# EAGLE schematic diffs (EAGLE 7.5.0)
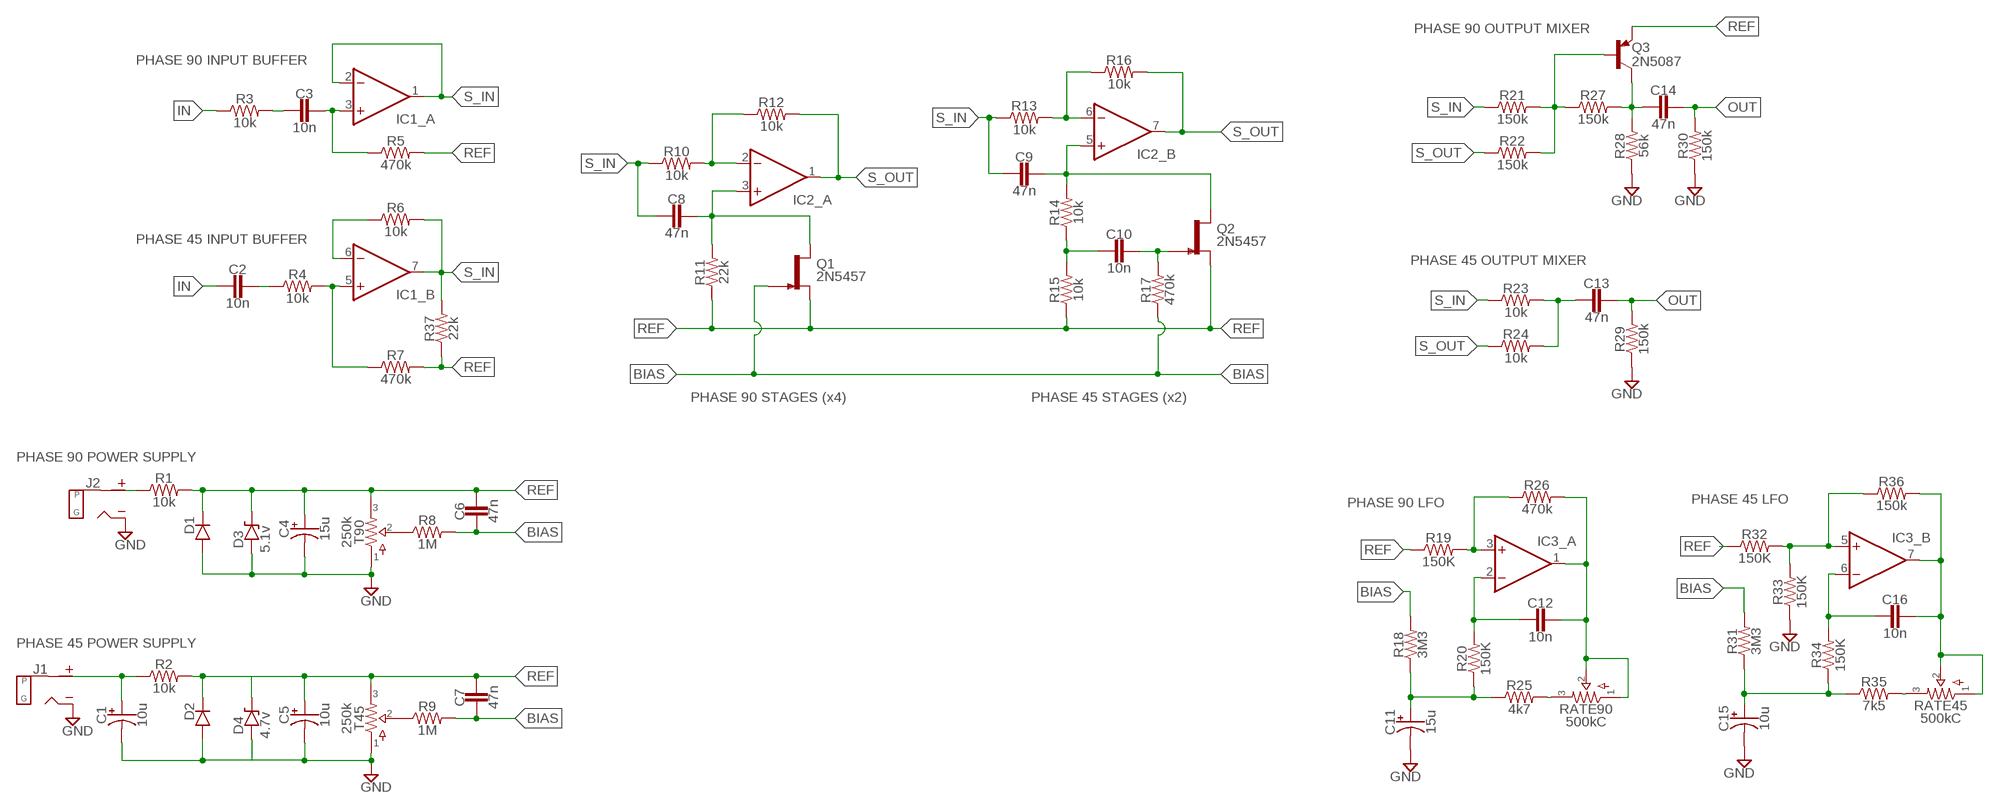
[diagram p0: schematic, sheet 1]

## Parts
C1  10u  0501B  [050_020_1B]
C2  10n  CER/FILM2  [050X030_025_2]
C3  10n  CER/FILM2  [050X030_025_2]
C4  15u  0501B  [050_020_1B]
C5  10u  0501B  [050_020_1B]
C6  47n  CER/FILM2  [050X030_025_2]
C7  47n  CER/FILM2  [050X030_025_2]
C8  47n  CER/FILM2  [050X030_025_2]
C9  47n  CER/FILM2  [050X030_025_2]
C10  10n  CER/FILM2  [050X030_025_2]
C11  15u  0501B  [050_020_1B]
C12  10n  CER/FILM2  [050X030_025_2]
C13  47n  CER/FILM2  [050X030_025_2]
C14  47n  CER/FILM2  [050X030_025_2]
C15  10u  0501B  [050_020_1B]
C16  10n  CER/FILM2  [050X030_025_2]
D1  DO35.3  [DO35-3]
D2  DO35.3  [DO35-3]
D3  5.1v  ZENER.3  [DO41-3]
D4  4.7v  ZENER.3  [DO41-3]
IC1  DUALTH  [DIL08]
IC2  QUADTH  [DIL14]
IC3  DUALTH  [DIL08]
J1  DC_MONO  [DC]
J2  DC_MONO  [DC]
Q1  2N5457  [TO92-]
Q2  2N5457  [TO92-]
Q3  2N5087  2N5087.1  [TO92-]
R1  10k  R_.2  [R0207/2V]
R2  10k  R_.2  [R0207/2V]
R3  10k  R_.2  [R0207/2V]
R4  10k  R_.2  [R0207/2V]
R5  470k  R_.2  [R0207/2V]
R6  10k  R_.2  [R0207/2V]
R7  470k  R_.2  [R0207/2V]
R8  1M  R_.2  [R0207/2V]
R9  1M  R_.2  [R0207/2V]
R10  10k  R_.2  [R0207/2V]
R11  22k  R_.2  [R0207/2V]
R12  10k  R_.2  [R0207/2V]
R13  10k  R_.2  [R0207/2V]
R14  10k  R_.2  [R0207/2V]
R15  10k  R_.2  [R0207/2V]
R16  10k  R_.2  [R0207/2V]
R17  470k  R_.2  [R0207/2V]
R18  3M3  R_.2  [R0207/2V]
R19  150K  R_.2  [R0207/2V]
R20  150K  R_.2  [R0207/2V]
R21  150k  R_.2  [R0207/2V]
R22  150k  R_.2  [R0207/2V]
R23  10k  R_.2  [R0207/2V]
R24  10k  R_.2  [R0207/2V]
R25  4k7  R_.2  [R0207/2V]
R26  470k  R_.2  [R0207/2V]
R27  150k  R_.2  [R0207/2V]
R28  56k  R_.2  [R0207/2V]
R29  150k  R_.2  [R0207/2V]
R30  150k  R_.2  [R0207/2V]
R31  3M3  R_.2  [R0207/2V]
R32  150K  R_.2  [R0207/2V]
R33  150K  R_.2  [R0207/2V]
R34  150K  R_.2  [R0207/2V]
R35  7k5  R_.2  [R0207/2V]
R36  150k  R_.2  [R0207/2V]
R37  22k  R_.2  [R0207/2V]
RATE45  500kC  POTSTRIM  [2262_TRIM]
RATE90  500kC  POTSTRIM  [2262_TRIM]
T45  250k  POTSTRIM  [2262_TRIM]
T90  250k  POTSTRIM  [2262_TRIM]

## Nets
BIAS: C6.1 C7.1 Q1.1(G) R8.2 R9.2 R17.1 R18.2 R31.2
GND: C4.- C5.- C11.- C15.- D1.A D3.A J1.S(SLEEVE) J2.S(SLEEVE) R28.1 R29.1 R30.1 R33.1 T45.1 T90.1
IN: C2.1 R3.1
N$1: IC2.6(_B:-IN) R13.2 R16.1
N$2: J2.T(TIP) R1.1
N$3: IC2.2(_A:-IN) R10.2 R12.1
N$4: C8.2 IC2.3(_A:+IN) Q1.3(D) R11.2
N$5: C1.+ J1.T(TIP) R2.1
N$6: C9.2 IC2.5(_B:+IN) Q2.3(D) R14.2
N$7: R9.1 T45.2
N$8: C10.1 R14.1 R15.2
N$9: C10.2 Q2.1(G) R17.2
N$10: IC3.3(_A:+IN) R19.2 R26.1
N$11: C12.1 IC3.2(_A:-IN) R20.2
N$12: C12.2 IC3.1(_A:OUT) R26.2 RATE90.1 RATE90.2
N$13: R25.2 RATE90.3
N$14: C11.+ R18.1 R20.1 R25.1
N$15: R8.1 T90.2
N$16: IC1.5(_B:+IN) R4.2 R7.1
N$17: IC3.5(_B:+IN) R32.2 R33.2 R36.1
N$18: C16.2 IC3.7(_B:OUT) R36.2 RATE45.1 RATE45.2
N$19: C16.1 IC3.6(_B:-IN) R34.2
N$20: R35.2 RATE45.3
N$21: C15.+ R31.1 R34.1 R35.1
N$22: C3.1 R3.2
N$23: C3.2 IC1.3(_A:+IN) R5.1
N$24: C2.2 R4.1
N$25: IC1.6(_B:-IN) R6.1
N$26: Q3.2(B) R21.2 R22.2
N$27: C13.1 R23.2 R24.2
N$28: R27.1
N$29: C1.- D2.A D4.A
N$30: C14.1 Q3.1(C) R27.2 R28.2
N$31: R37.2
OUT: C13.2 C14.2 R29.2 R30.2
REF: C4.+ C5.+ C6.2 C7.2 D1.C D2.C D3.C D4.C Q1.2(S) Q2.2(S) Q3.3(E) R1.2 R2.2 R5.2 R7.2 R11.1 R15.1 R19.1 R32.1 R37.1 T45.3 T90.3
S_IN: C8.1 C9.1 IC1.1(_A:OUT) IC1.2(_A:-IN) IC1.7(_B:OUT) R6.2 R10.1 R13.1 R21.1 R23.1
S_OUT: IC2.1(_A:OUT) IC2.7(_B:OUT) R12.2 R16.2 R22.1 R24.1
Unconnected: IC2.8(_C:OUT) IC2.9(_C:-IN) IC2.10(_C:+IN) IC2.12(_D:+IN) IC2.13(_D:-IN) IC2.14(_D:OUT)

## Notes on the sheet
- PHASE 90 OUTPUT MIXER
- PHASE 90 INPUT BUFFER
- PHASE 45 INPUT BUFFER
- PHASE 45 OUTPUT MIXER
- PHASE 90 STAGES (x4) | PHASE 45 STAGES (x2)
- PHASE 90 POWER SUPPLY
- PHASE 90 LFO | PHASE 45 LFO
- PHASE 45 POWER SUPPLY

## Power pins joined to a net without a drawn wire
V+: IC1.8(_PWR:V+) IC2.4(_PWR:V+) IC3.8(_PWR:V+)
V-: IC1.4(_PWR:V-) IC2.11(_PWR:V-) IC3.4(_PWR:V-)

## Library data of the parts
C1 C4 C5 C11 C15 = capacitors-elec:050: 0.22 - 100uF Xicon values at Mouser.com: 10V: 10 - 100uF; 16V: 2.2 - 47uF; 25V: 0.47 - 47uF; 50V: 0.22 - 22uF
C2 C3 C6-C10 C12-C14 C16 = capacitors-film:CER/FILM: 47 - 120pF Xicon Ceramic Disc 2.5mm lead spacing
D1 D2 = diodes:DO35: DO-35 Package Diodes: 1N914
D3 D4 = diodes:ZENER
IC1 IC3 = integrated circuits:DUAL: OP AMP
IC2 = integrated circuits:QUAD: OP AMP
J1 J2 = jacks:DC_MONO
Q1 Q2 = transistors:2N5457: N-CHANNEL JFET
Q3 = transistors:2N5087: PNP Transistor
R1-R37 = resistors:R_
RATE45 RATE90 T45 T90 = potentiometers:POTS